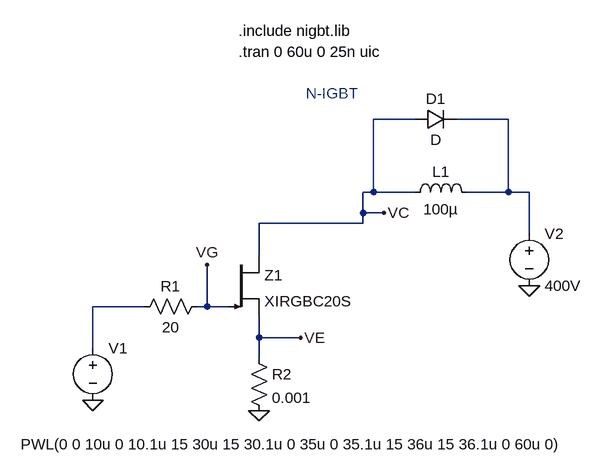
[diagram p0: schematic NIGBT.asc]
NIGBT.asc, the LTspice schematic file:
Version 4.1
SHEET 1 880 680
WIRE 224 -320 160 -320
WIRE 368 -320 288 -320
WIRE 160 -208 160 -320
WIRE 160 -208 144 -208
WIRE 224 -208 160 -208
WIRE 368 -208 368 -320
WIRE 368 -208 304 -208
WIRE 400 -208 368 -208
WIRE 144 -176 144 -208
WIRE 176 -176 144 -176
WIRE 144 -160 144 -176
WIRE 144 -160 -16 -160
WIRE 400 -144 400 -208
WIRE -16 -112 -16 -160
WIRE -192 -32 -272 -32
WIRE -96 -32 -96 -96
WIRE -96 -32 -112 -32
WIRE -64 -32 -96 -32
WIRE -16 16 -16 -16
WIRE 48 16 -16 16
WIRE -272 32 -272 -32
WIRE -16 48 -16 16
FLAG -16 128 0
FLAG -272 112 0
FLAG 400 -64 0
FLAG -96 -96 VG
FLAG 48 16 VE
FLAG 176 -176 VC
SYMBOL Misc\\NIGBT -64 -112 R0
SYMATTR InstName Z1
SYMATTR Value XIRGBC20S
SYMATTR Prefix X
SYMBOL res -96 -48 R90
WINDOW 0 0 56 VBottom 2
WINDOW 3 32 56 VTop 2
SYMATTR InstName R1
SYMATTR Value 20
SYMBOL res -32 32 R0
SYMATTR InstName R2
SYMATTR Value 0.001
SYMBOL voltage -272 16 R0
WINDOW 3 -111 164 Left 2
SYMATTR Value PWL(0 0 10u 0 10.1u 15 30u 15 30.1u 0 35u 0 35.1u 15 36u 15 36.1u 0 60u 0)
SYMATTR InstName V1
SYMBOL voltage 400 -160 R0
WINDOW 123 0 0 Left 0
WINDOW 39 0 0 Left 0
SYMATTR InstName V2
SYMATTR Value 400V
SYMBOL ind 208 -192 R270
WINDOW 0 32 56 VTop 2
WINDOW 3 5 56 VBottom 2
SYMATTR InstName L1
SYMATTR Value 100µ
SYMATTR SpiceLine Rser=1m
SYMBOL diode 224 -304 R270
WINDOW 0 32 32 VTop 2
WINDOW 3 0 32 VBottom 2
SYMATTR InstName D1
TEXT -48 -456 Left 2 !.include nigbt.lib
TEXT -48 -424 Left 2 !.tran 0 60u 0 25n uic
TEXT 56 -360 Left 2 ;N-IGBT

The netlist it stands for:
* NIGBT.asc
X§Z1 VC VG VE XIRGBC20S  ; pins C G E
R1 VG N002 20
R2 VE 0 0.001
V1 N002 0 PWL(0 0 10u 0 10.1u 15 30u 15 30.1u 0 35u 0 35.1u 15 36u 15 36.1u 0 60u 0)
V2 N001 0 400V
L1 VC N001 100µ Rser=1m
D1 VC N001 D
.model D D
.lib standard.dio
.include nigbt.lib
.tran 0 60u 0 25n uic
* N-IGBT
.backanno
.end